# EAGLE design 54HC595 SHIFT REGISTER BOARD 1 (EAGLE 9.0.1)
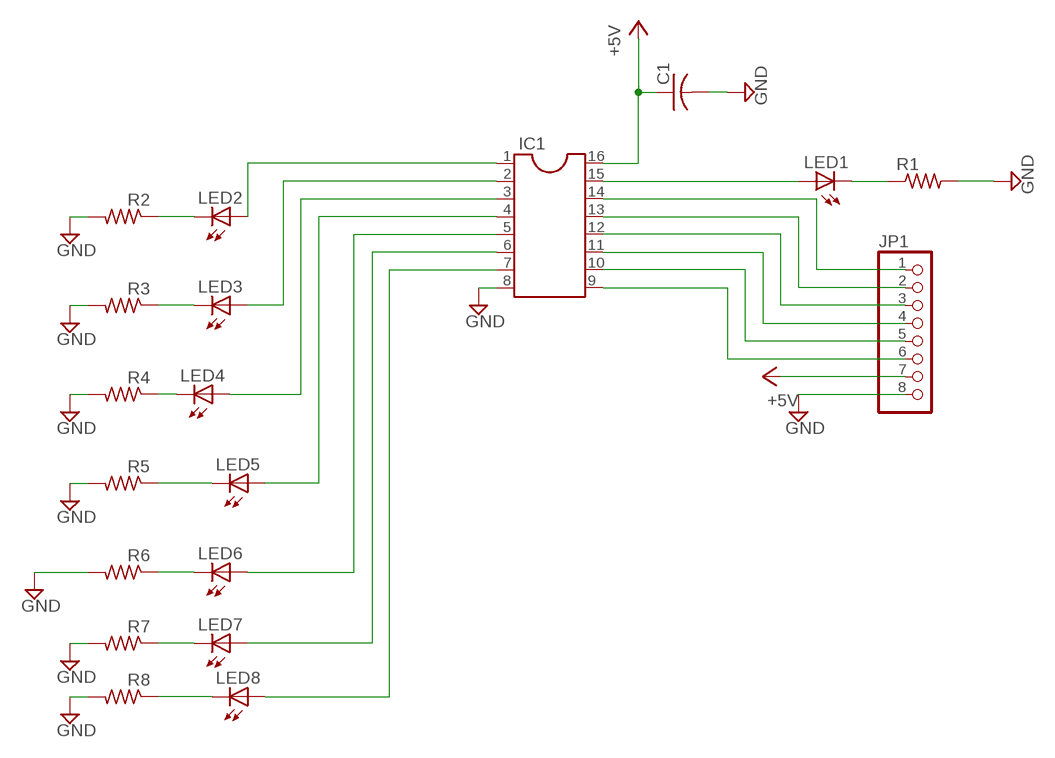
[diagram p0: schematic, sheet 1]

## Parts
C1  C-US050-025X075  [C050-025X075]
IC1  DIL16  [DIL16]
JP1  PINHD-1X8  [1X08]
LED1  LEDCHIPLED_0805  [CHIPLED_0805]
LED2  LEDCHIPLED_0805  [CHIPLED_0805]
LED3  LEDCHIPLED_0805  [CHIPLED_0805]
LED4  LEDCHIPLED_0805  [CHIPLED_0805]
LED5  LEDCHIPLED_0805  [CHIPLED_0805]
LED6  LEDCHIPLED_0805  [CHIPLED_0805]
LED7  LEDCHIPLED_0805  [CHIPLED_0805]
LED8  LEDCHIPLED_0805  [CHIPLED_0805]
R1  R-US_0309/V  [0309V]
R2  R-US_0309/V  [0309V]
R3  R-US_0309/V  [0309V]
R4  R-US_0309/V  [0309V]
R5  R-US_0309/V  [0309V]
R6  R-US_0309/V  [0309V]
R7  R-US_0309/V  [0309V]
R8  R-US_0309/V  [0309V]

## Nets
+5V: C1.1 IC1.16 JP1.7
GND: C1.2 IC1.8 JP1.8 R1.2 R2.2 R3.2 R4.2 R5.2 R6.2 R7.2 R8.2
N$1: IC1.15 LED1.A
N$2: IC1.1 LED2.A
N$3: IC1.2 LED3.A
N$4: IC1.3 LED4.A
N$5: IC1.4 LED5.A
N$6: IC1.5 LED6.A
N$7: IC1.6 LED7.A
N$8: IC1.7 LED8.A
N$9: LED8.C R8.1
N$10: LED7.C R7.1
N$11: LED6.C R6.1
N$12: LED5.C R5.1
N$13: LED4.C R4.1
N$14: LED3.C R3.1
N$15: LED2.C R2.1
N$16: IC1.14 JP1.1
N$17: IC1.13 JP1.2
N$18: IC1.12 JP1.3
N$19: IC1.11 JP1.4
N$20: IC1.10 JP1.5
N$21: IC1.9 JP1.6
N$22: LED1.C R1.1

## Library data of the parts
C1 = resistor:C-US: CAPACITOR, American symbol
IC1 = ic-package:DIL16: Dual In Line / Socket
JP1 = pinhead:PINHD-1X8: PIN HEADER
LED1-LED8 = led:LED: LED OSRAM: - CHIPLED LG R971, LG N971, LY N971, LG Q971, LY Q971, LO R971, LY R971 LH N974, LH R974 LS Q976, LO Q976, LY Q976 LO Q996 - Hyper CHIPLED LW Q18S LB Q993, LB Q99A, LB R99A - SideLED LS A670, LO A670, LY A670, LG A670, LP A670 LB A673, LV A673, LT A673, LW A673 LH A674 LY A675 LS A676, LA A676, LO A676, LY A676, LW A676 LS A679, LY A679, LG A679 - Hyper Micro SIDELED® LS Y876, LA Y876, LO Y876, LY Y876 LT Y87S - SmartLED LW L88C, LW L88S LB L89C, LB L89S, LG L890 LS L89K, LO L89K, LY L89K LS L896, LA L896, LO L896, LY L896 - TOPLED LS T670, LO T670, LY T670, LG T670, LP T670 LSG T670, LSP T670, LSY T670, LOP T670, LYG T670 LG T671, LOG T671, LSG T671 LB T673, LV T673, LT T673, LW T673 LH T674 LS T676, LA T676, LO T676, LY T676, LB T676, LH T676, LSB T676, LW T676 LB T67C, LV T67C, LT T67C, LS T67K, LO T67K, LY T67K, LW E67C LS E67B, LA E67B, LO E67B, LY E67B, LB E67C, LV E67C, LT E67C LW T67C LS T679, LY T679, LG T679 LS T770, LO T770, LY T770, LG T770, LP T770 LB T773, LV T773, LT T773, LW T773 LH T774 LS E675, LA E675, LY E675, LS T675 LS T776, LA T776, LO T776, LY T776, LB T776 LHGB T686 LT T68C, LB T68C - Hyper Mini TOPLED® LB M676 - Mini TOPLED Santana® LG M470 LS M47K, LO M47K, LY M47K Source: http://www.osram.convergy.de LUXEON: - LUMILED® LXK2-PW12-R00, LXK2-PW12-S00, LXK2-PW14-U00, LXK2-PW14-V00 LXK2-PM12-R00, LXK2-PM12-S00, LXK2-PM14-U00 LXK2-PE12-Q00, LXK2-PE12-R00, LXK2-PE12-S00, LXK2-PE14-T00, LXK2-PE14-U00 LXK2-PB12-K00, LXK2-PB12-L00, LXK2-PB12-M00, LXK2-PB14-N00, LXK2-PB14-P00, LXK2-PB14-Q00 LXK2-PR12-L00, LXK2-PR12-M00, LXK2-PR14-Q00, LXK2-PR14-R00 LXK2-PD12-Q00, LXK2-PD12-R00, LXK2-PD12-S00 LXK2-PH12-R00, LXK2-PH12-S00 LXK2-PL12-P00, LXK2-PL12-Q00, LXK2-PL12-R00 Source: www.luxeon.com KINGBRIGHT: KA-3528ASYC Source: www.kingbright.com
R1-R8 = resistor:R-US_: RESISTOR, American symbol

## Net classes
0 default: width 0.254 mm, clearance 0.254 mm

## Board
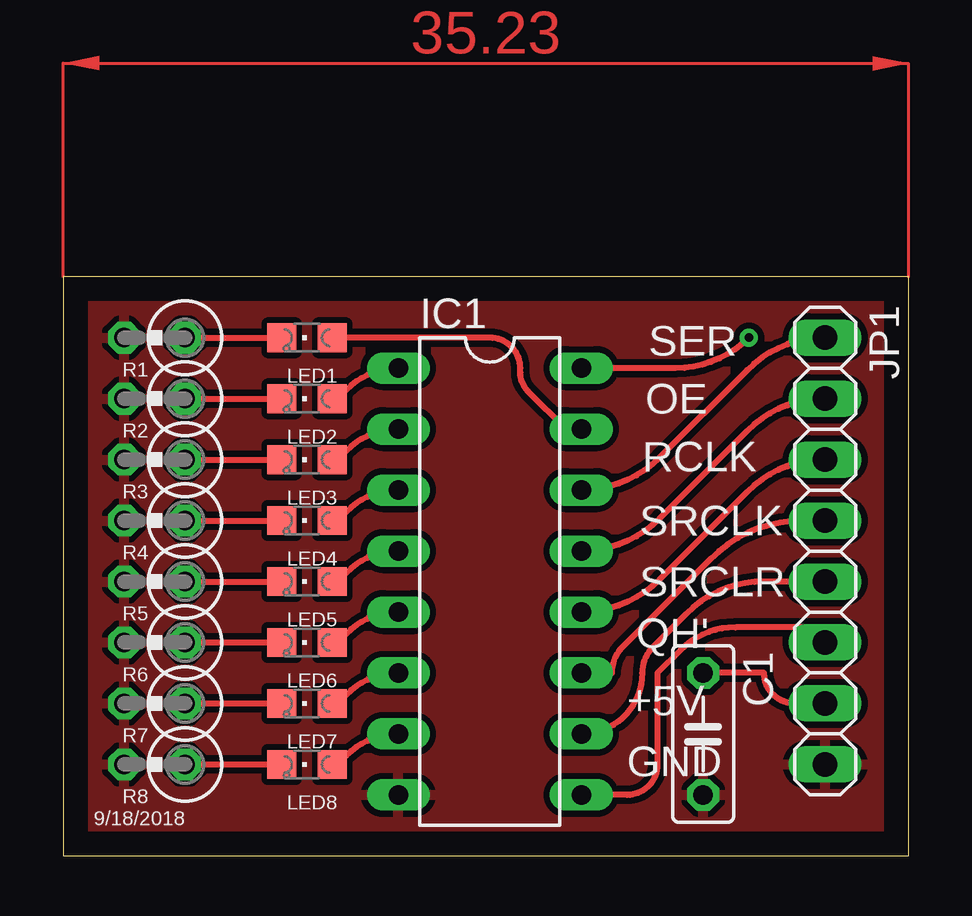
[diagram p1: board, top side]
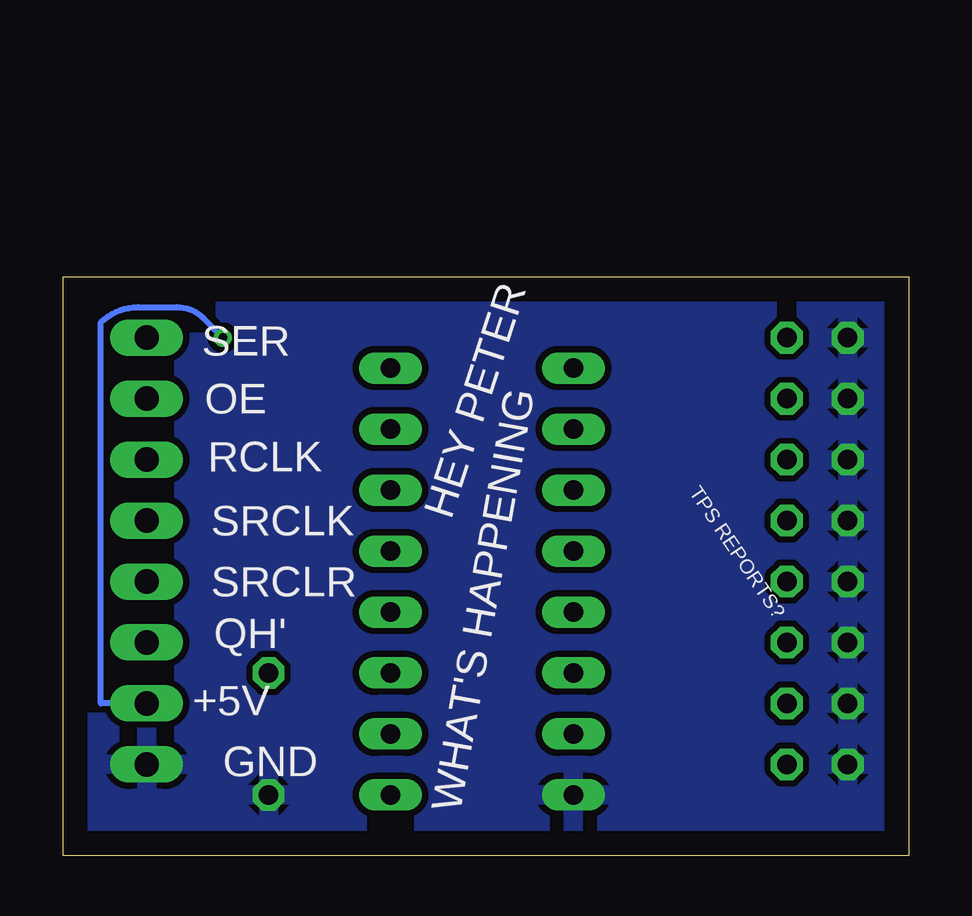
[diagram p2: board, bottom side, seen from below]

Size 35.23 x 24.12 mm. Coordinates in mm from the lower left corner, seen from the top.
Outline: 0,0 35.23,0 35.23,24.12 0,24.12 0,0
Copper layers (1*16): Top 0.035mm / dielectric 1.5mm / Bottom 0.035mm
Design rules "default": minimum track width 6mil, minimum drill 0.35mm, track to track 6mil, track to pad 6mil, pad to pad 6mil, via to via 6mil, smd to smd 6mil, copper to edge 40mil, drill to drill 6mil, minimum pad ring 10mil, minimum via ring 8mil, stop-mask expansion 4mil, vias tented up to drill 0mil, thermal gap 10mil

### Footprints (pad centres in the part's own frame; a part is rotated, then mirrored left to right if it is on the bottom)
C050-025X075 = drill 0.813 octagon: 1 -2.54,0; 2 2.54,0
DIL16 = drill 0.813 long: 1 -8.89,-3.81; 2 -6.35,-3.81; 3 -3.81,-3.81; 4 -1.27,-3.81; 5 1.27,-3.81; 6 3.81,-3.81; 7 6.35,-3.81; 8 8.89,-3.81; 9 8.89,3.81; 10 6.35,3.81; 11 3.81,3.81; 12 1.27,3.81; 13 -1.27,3.81; 14 -3.81,3.81; 15 -6.35,3.81; 16 -8.89,3.81
1X08 = drill 1.016 long: 1 -8.89,0; 2 -6.35,0; 3 -3.81,0; 4 -1.27,0; 5 1.27,0; 6 3.81,0; 7 6.35,0; 8 8.89,0
CHIPLED_0805 = smd 1.2 x 1.2: A 0,-1.05; C 0,1.05
0309V = drill 0.813 octagon: 1 -1.27,0; 2 1.27,0

### Placement (x,y rotation side)
C1  26.67,5.08 270 top
IC1  17.78,11.43 270 top
JP1  31.75,12.7 270 top
LED1  10.16,21.59 90 top
LED2  10.16,19.05 90 top
LED3  10.16,16.51 90 top
LED4  10.16,13.97 90 top
LED5  10.16,11.43 90 top
LED6  10.16,8.89 90 top
LED7  10.16,6.35 90 top
LED8  10.16,3.81 90 top
R1  3.81,21.59 180 top
R2  3.81,19.05 180 top
R3  3.81,16.51 180 top
R4  3.81,13.97 180 top
R5  3.81,11.43 180 top
R6  3.81,8.89 180 top
R7  3.81,6.35 180 top
R8  3.81,3.81 180 top

### Tracks (layer width: path | path; a pad name or v marks a point on that pad's centre or on a via)
+5V  (via drill 0.35)
  Top 0.254: C1.1 29.21,7.62 arc90 30.48,6.35 JP1.7 | v28.57,21.59 arc-45 25.51,20.32 IC1.16
  Bottom 0.254: v28.57,21.59 29.4,22.41 arc-45 30.48,22.86 32.12,22.86 arc-45 33.66,22.23 33.66,6.35 JP1.7
GND
  pour Top: -15.24,50.8 101.6,50.8 134.62,12.7 134.62,-54.61 113.03,-76.2 -16.51,-76.2 -17.78,-77.47 -17.78,48.26
  pour Bottom: -60.96,87.63 186.69,87.63 232.41,41.91 232.41,-172.72 223.52,-181.61 -29.21,-181.61 -48.26,-162.56 -60.96,-149.86
N$1
  Top 0.254: LED1.A 17.78,21.59 arc-90 19.05,20.32 19.05,20.13 arc45 19.37,19.37 20.96,17.78 IC1.15
N$2
  Top 0.254: IC1.1 arc45 11.8,19.42 11.43,19.05 LED2.A
N$3
  Top 0.254: IC1.2 arc45 11.8,16.88 11.43,16.51 LED3.A
N$4
  Top 0.254: IC1.3 arc45 11.8,14.34 11.43,13.97 LED4.A
N$5
  Top 0.254: IC1.4 arc45 11.8,11.8 11.43,11.43 LED5.A
N$6
  Top 0.254: IC1.5 arc45 11.8,9.26 11.43,8.89 LED6.A
N$7
  Top 0.254: IC1.6 arc45 11.8,6.72 11.43,6.35 LED7.A
N$8
  Top 0.254: IC1.7 arc45 11.8,4.18 11.43,3.81 LED8.A
N$9
  Top 0.254: R8.1 LED8.C
N$10
  Top 0.254: R7.1 LED7.C
N$11
  Top 0.254: R6.1 LED6.C
N$12
  Top 0.254: R5.1 LED5.C
N$13
  Top 0.254: R4.1 LED4.C
N$14
  Top 0.254: R3.1 LED3.C
N$15
  Top 0.254: R2.1 LED2.C
N$16
  Top 0.254: JP1.1 arc45 28.5,20.24 24.84,16.59 arc-45 IC1.14
N$17
  Top 0.254: JP1.2 arc45 28.5,17.7 24.84,14.05 arc-45 IC1.13
N$18
  Top 0.254: JP1.3 arc45 28.5,15.16 24.84,11.51 arc-45 IC1.12
N$19
  Top 0.254: IC1.11 22.86,7.62 arc-45 23.31,8.7 26.99,12.38 arc-45 30.82,13.97 JP1.4
N$20
  Top 0.254: 24.13,7.62 arc-45 24.58,8.7 25.96,10.08 arc-45 29.21,11.43 JP1.5 | 24.13,7.62 arc-90 IC1.10 | 24.13,7.62 arc-90 IC1.10 | 24.13,7.62 arc-90 IC1.10 | 24.13,7.62 arc-90 IC1.10 | 24.13,7.62 arc-90 IC1.10 | 24.13,7.62 arc-90 IC1.10 | 24.13,7.62 arc-90 IC1.10 | 24.13,7.62 arc-90 IC1.10 | 24.13,7.62 arc-90 IC1.10
N$21
  Top 0.254: IC1.9 23.5,2.54 arc90 24.77,3.81 24.77,7.62 25.72,8.57 arc-45 28.02,9.52 31.75,9.52 JP1.6
N$22
  Top 0.254: R1.1 LED1.C
(copper drawn outside any net)
  shapes: Top area x1

### Text on the board
tPlace: SER | OE | RCLK | SRCLK | SRCLR | QH' | +5V | GND | 9/18/2018
bPlace: SER | OE | RCLK | HEY PETER | SRCLK | TPS REPORTS? | SRCLR | QH' | +5V | GND | WHAT'S HAPPENING